# EAGLE design medidor-2 (EAGLE 9.6.2)
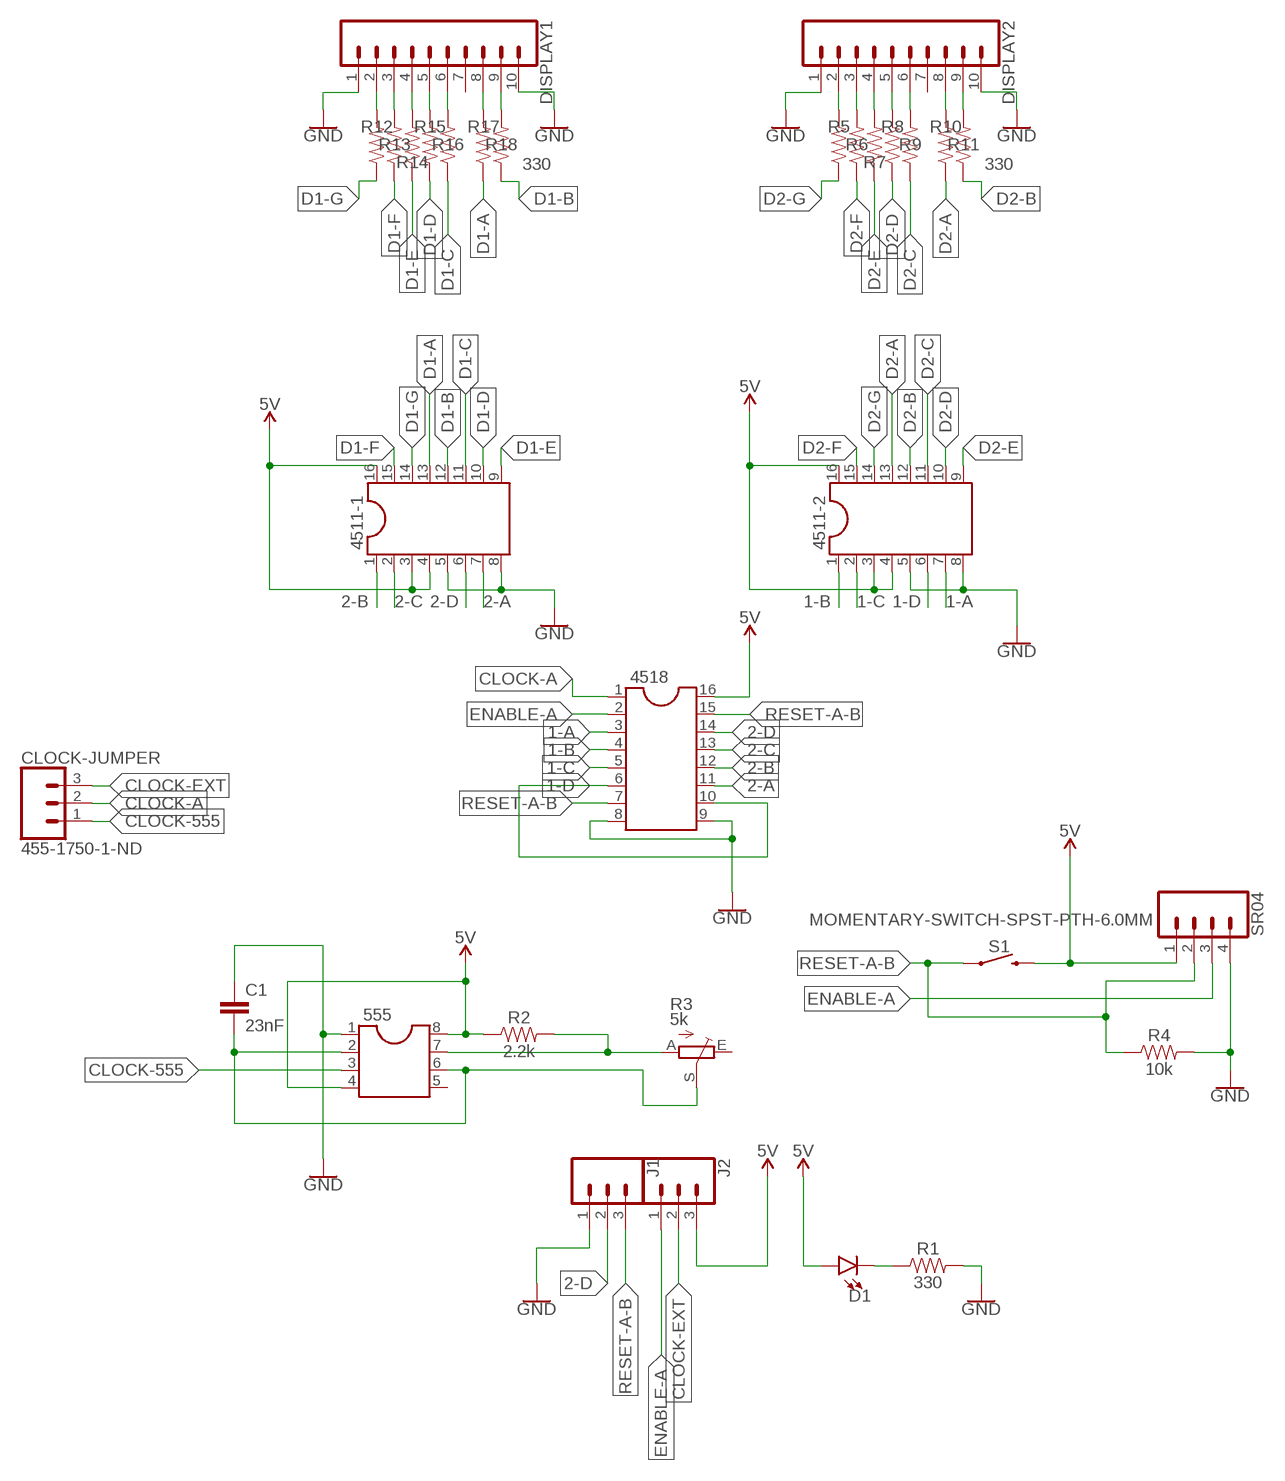
[diagram p0: schematic, sheet 1]

## Parts
555  DIL8  [DIL08]
4511-1  DIL16  [DIL16]
4511-2  DIL16  [DIL16]
4518  DIL16  [DIL16]
C1  23nF  C2,5-3  [C2.5-3]
CLOCK-JUMPER  455-1750-1-ND  CONN_03  [1X03]
D1  LED5MM  [LED_5MM]
DISPLAY1  CONN_10"  [1X10]
DISPLAY2  CONN_10"  [1X10]
J1  CONN_03-SCREW-5MM  [SCREWTERMINAL-5MM-3]
J2  CONN_03-SCREW-5MM  [SCREWTERMINAL-5MM-3]
R1  330  10KOHM-HORIZ-1/4W-5%  [AXIAL-0.3]
R2  2.2k  10KOHM-HORIZ-1/4W-5%  [AXIAL-0.3]
R3  5k  TRIM_EU-B25P  [B25P]
R4  10k  10KOHM-HORIZ-1/4W-5%  [AXIAL-0.3]
R5  330  10KOHM-HORIZ-1/4W-5%  [AXIAL-0.3]
R6  330  10KOHM-HORIZ-1/4W-5%  [AXIAL-0.3]
R7  330  10KOHM-HORIZ-1/4W-5%  [AXIAL-0.3]
R8  330  10KOHM-HORIZ-1/4W-5%  [AXIAL-0.3]
R9  330  10KOHM-HORIZ-1/4W-5%  [AXIAL-0.3]
R10  330  10KOHM-HORIZ-1/4W-5%  [AXIAL-0.3]
R11  330  10KOHM-HORIZ-1/4W-5%  [AXIAL-0.3]
R12  330  10KOHM-HORIZ-1/4W-5%  [AXIAL-0.3]
R13  330  10KOHM-HORIZ-1/4W-5%  [AXIAL-0.3]
R14  330  10KOHM-HORIZ-1/4W-5%  [AXIAL-0.3]
R15  330  10KOHM-HORIZ-1/4W-5%  [AXIAL-0.3]
R16  330  10KOHM-HORIZ-1/4W-5%  [AXIAL-0.3]
R17  330  10KOHM-HORIZ-1/4W-5%  [AXIAL-0.3]
R18  330  10KOHM-HORIZ-1/4W-5%  [AXIAL-0.3]
S1  MOMENTARY-SWITCH-SPST-PTH-6.0MM  [TACTILE_SWITCH_PTH_6.0MM]
SR04  CONN_04PTH  [1X04]

## Nets
1-A: 4511-2.7 4518.3
1-B: 4511-2.1 4518.4
1-C: 4511-2.2 4518.5
1-D: 4511-2.6 4518.6 4518.10
2-A: 4511-1.7 4518.11
2-B: 4511-1.1 4518.12
2-C: 4511-1.2 4518.13
2-D: 4511-1.6 4518.14 J1.2
5V: 555.4 555.8 4511-1.3 4511-1.4 4511-1.16 4511-2.3 4511-2.4 4511-2.16 4518.16 D1.A J2.3 R2.P$1 S1.3 SR04.1
CLOCK-555: 555.3 CLOCK-JUMPER.1
CLOCK-A: 4518.1 CLOCK-JUMPER.2
CLOCK-EXT: CLOCK-JUMPER.3 J2.2
D1-A: 4511-1.13 R17.P$1
D1-B: 4511-1.12 R18.P$1
D1-C: 4511-1.11 R16.P$1
D1-D: 4511-1.10 R15.P$1
D1-E: 4511-1.9 R14.P$1
D1-F: 4511-1.15 R13.P$1
D1-G: 4511-1.14 R12.P$1
D2-A: 4511-2.13 R10.P$1
D2-B: 4511-2.12 R11.P$1
D2-C: 4511-2.11 R9.P$1
D2-D: 4511-2.10 R8.P$1
D2-E: 4511-2.9 R7.P$1
D2-F: 4511-2.15 R6.P$1
D2-G: 4511-2.14 R5.P$1
ENABLE-A: 4518.2 J2.1 SR04.3
GND: 555.1 4511-1.5 4511-1.8 4511-2.5 4511-2.8 4518.8 4518.9 C1.1 DISPLAY1.1 DISPLAY1.10 DISPLAY2.1 DISPLAY2.10 J1.1 R1.P$2 R4.P$2 SR04.4
N$1: D1.K(C) R1.P$1
N$2: DISPLAY1.2 R12.P$2
N$3: 555.7 R2.P$2 R3.A
N$5: 555.2 555.6 C1.2 R3.S
N$6: DISPLAY1.3 R13.P$2
N$7: DISPLAY1.4 R14.P$2
N$8: DISPLAY1.5 R15.P$2
N$9: DISPLAY1.6 R16.P$2
N$10: DISPLAY1.8 R17.P$2
N$11: DISPLAY1.9 R18.P$2
N$12: DISPLAY2.2 R5.P$2
N$13: DISPLAY2.3 R6.P$2
N$14: DISPLAY2.4 R7.P$2
N$15: DISPLAY2.5 R8.P$2
N$16: DISPLAY2.6 R9.P$2
N$17: DISPLAY2.8 R10.P$2
N$18: DISPLAY2.9 R11.P$2
RESET-A-B: 4518.7 4518.15 J1.3 R4.P$1 S1.1 SR04.2
Unconnected: 555.5 DISPLAY1.7 DISPLAY2.7 R3.E

## Library data of the parts
555 = ic-package:DIL8: Dual In Line / Socket
4511-1 4511-2 4518 = ic-package:DIL16: Dual In Line / Socket
C1 = capacitor-wima:C: CAPACITOR naming: grid - package width
CLOCK-JUMPER = SparkFun-Connectors:CONN_03: Multi connection point. Often used as Generic Header-pin footprint for 0.1 inch spaced/style header connections On any of the 0.1 inch spaced packages, you can populate with these: Break Away Headers - Straight <https://www.sparkfun.com/products/116> (PRT-00116) Break Away Male Headers - Right Angle <https://www.sparkfun.com/products/553> (PRT-00553) Female Headers <https://www.sparkfun.com/products/115> (PRT-00115) Break Away Headers - Machine Pin <https://www.sparkfun.com/products/117> (PRT-00117) Break Away Female Headers - Swiss Machine Pin <https://www.sparkfun.com/products/743> (PRT-00743) Stackable Header - 3 Pin (Female, 0.1") <https://www.sparkfun.com/products/13875> (PRT-13875) For SCREWTERMINALS and SPRING TERMINALS visit here: Screw Terimnals on SparkFun.com <https://www.sparkfun.com/search/results?term=Screw+Terminals> (5mm/3.5mm/2.54mm spacing) This device is also useful as a general connection point to wire up your design to another part of your project. Our various solder wires solder well into these plated through hole pads. Hook-Up Wire - Assortment (Stranded, 22 AWG) <https://www.sparkfun.com/products/11375> (PRT-11375) Hook-Up Wire - Assortment (Solid Core, 22 AWG) <https://www.sparkfun.com/products/11367> (PRT-11367) View the entire wire category on our website here <https://www.sparkfun.com/categories/141> Special notes: Molex polarized connector foot print use with SKU : PRT-08232 with associated crimp pins and housings.; PROD_ID: XXX-00000
D1 = SparkFun-LED:LED: LED (Generic) Standard schematic elements and footprints for 5mm, 3mm, 1206, and 0603 sized LEDs. Generic LEDs with no color specified.
DISPLAY1 DISPLAY2 = SparkFun-Connectors:CONN_10: Multi connection point. Often used as Generic Header-pin footprint for 0.1 inch spaced/style header connections On any of the 0.1 inch spaced packages, you can populate with these: Break Away Headers - Straight <https://www.sparkfun.com/products/116> (PRT-00116) Break Away Male Headers - Right Angle <https://www.sparkfun.com/products/553> (PRT-00553) Female Headers <https://www.sparkfun.com/products/115> (PRT-00115) Break Away Headers - Machine Pin <https://www.sparkfun.com/products/117> (PRT-00117) Break Away Female Headers - Swiss Machine Pin <https://www.sparkfun.com/products/743> (PRT-00743) Arduino Stackable Header - 10 Pin <https://www.sparkfun.com/products/11376> (PRT-11376) For SCREWTERMINALS and SPRING TERMINALS visit here: Screw Terimnals on SparkFun.com <https://www.sparkfun.com/search/results?term=Screw+Terminals> (5mm/3.5mm/2.54mm spacing) This device is also useful as a general connection point to wire up your design to another part of your project. Our various solder wires solder well into these plated through hole pads. Hook-Up Wire - Assortment (Stranded, 22 AWG) <https://www.sparkfun.com/products/11375> (PRT-11375) Hook-Up Wire - Assortment (Solid Core, 22 AWG) <https://www.sparkfun.com/products/11367> (PRT-11367) View the entire wire category on our website here <https://www.sparkfun.com/categories/141> Special notes: Molex polarized connector foot print use with SKU : PRT-08231 with associated crimp pins and housings. 1MM SMD Version SKU: PRT-10208 NOTES ON THE VARIANTS LOCK and LOCK_LONGPADS... This footprint was designed to help hold the alignment of a through-hole component (i.e. 6-pin header) while soldering it into place. You may notice that each hole has been shifted either up or down by 0.005 of an inch from it's more standard position (which is a perfectly straight line). This slight alteration caused the pins (the squares in the middle) to touch the edges of the holes. Because they are alternating, it causes a "brace" to hold the component in place. 0.005 has proven to be the perfect amount of "off-center" position when using our standard breakaway headers. Although looks a little odd when you look at the bare footprint, once you have a header in there, the alteration is very hard to notice. Also,if you push a header all the way into place, it is covered up entirely on the bottom side.; PROD_ID: CONN-11563
J1 J2 = SparkFun-Connectors:CONN_03: Multi connection point. Often used as Generic Header-pin footprint for 0.1 inch spaced/style header connections On any of the 0.1 inch spaced packages, you can populate with these: Break Away Headers - Straight <https://www.sparkfun.com/products/116> (PRT-00116) Break Away Male Headers - Right Angle <https://www.sparkfun.com/products/553> (PRT-00553) Female Headers <https://www.sparkfun.com/products/115> (PRT-00115) Break Away Headers - Machine Pin <https://www.sparkfun.com/products/117> (PRT-00117) Break Away Female Headers - Swiss Machine Pin <https://www.sparkfun.com/products/743> (PRT-00743) Stackable Header - 3 Pin (Female, 0.1") <https://www.sparkfun.com/products/13875> (PRT-13875) For SCREWTERMINALS and SPRING TERMINALS visit here: Screw Terimnals on SparkFun.com <https://www.sparkfun.com/search/results?term=Screw+Terminals> (5mm/3.5mm/2.54mm spacing) This device is also useful as a general connection point to wire up your design to another part of your project. Our various solder wires solder well into these plated through hole pads. Hook-Up Wire - Assortment (Stranded, 22 AWG) <https://www.sparkfun.com/products/11375> (PRT-11375) Hook-Up Wire - Assortment (Solid Core, 22 AWG) <https://www.sparkfun.com/products/11367> (PRT-11367) View the entire wire category on our website here <https://www.sparkfun.com/categories/141> Special notes: Molex polarized connector foot print use with SKU : PRT-08232 with associated crimp pins and housings.; PROD_ID: CONN-10134; SF_SKU: PRT-08433
R1 R2 R5-R18 = SparkFun-Resistors:10KOHM: 10kΩ resistor A resistor is a passive two-terminal electrical component that implements electrical resistance as a circuit element. Resistors act to reduce current flow, and, at the same time, act to lower voltage levels within circuits. - Wikipedia; PROD_ID: RES-09435; VALUE: 10k
R3 = pot:TRIM_EU-: POTENTIOMETER
R4 = SparkFun-Resistors:10KOHM: 10kΩ resistor A resistor is a passive two-terminal electrical component that implements electrical resistance as a circuit element. Resistors act to reduce current flow, and, at the same time, act to lower voltage levels within circuits. - Wikipedia; PROD_ID: RES-09435
S1 = SparkFun-Switches:MOMENTARY-SWITCH-SPST: Momentary Switch (Pushbutton) - SPST Normally-open (NO) SPST momentary switches (buttons, pushbuttons). Variants PTH-12MM - 12mm square, through-hole Momentary Pushbutton Switch - 12mm Square <https://www.sparkfun.com/products/9190> (COM-09190) PTH-6.0MM, PTH-6.0MM-KIT - 6.0mm square, through-hole Mini Pushbutton Switch <https://www.sparkfun.com/products/97> (COM-00097) KIT package intended for soldering kit's - only one side of pads' copper is exposed. PTH-RIGHT-ANGLE-KIT - Right-angle, through-hole Right Angle Tactile Button <https://www.sparkfun.com/products/10791> - Used on SparkFun BigTime Watch Kit <https://www.sparkfun.com/products/11734> SMD-12MM - 12mm square, surface-mount Tactile Button - SMD (12mm) <https://www.sparkfun.com/products/12993> (COM-12993) Used on SparkFun PicoBoard <https://www.sparkfun.com/products/11888> SMD-4.5MM - 4.5mm Square Trackball Switch Used on SparkFun Blackberry Trackballer Breakout <https://www.sparkfun.com/products/13169> SMD-4.6MMX2.8MM - 4.60mm x 2.80mm, surface mount Used on SparkFun SAMD21 Mini Breakout <https://www.sparkfun.com/products/13664> SMD-5.2MM, SMD-5.2-REDUNDANT - 5.2mm square, surface-mount Mini Pushbutton Switch - SMD <https://www.sparkfun.com/products/8720> (COM-08720) Used on Arduino Pro Mini <https://www.sparkfun.com/products/11114> REDUNDANT package connects both switch circuits together SMD-6.0X3.5MM - 6.0 x 3.5mm, surface mount Momentary Reset Switch SMD <https://www.sparkfun.com/products/8229> (COM-08229) SMD-6.2MM-TALL - 6.2mm square, surface mount Tactile Button - SMD (6mm) <https://www.sparkfun.com/products/12992> Used on SparkFun Digital Sandbox <https://www.sparkfun.com/products/12651> SMD-RIGHT-ANGLE - Right-angle, surface mount Used on SparkFun Block for Intel® Edison - Arduino <https://www.sparkfun.com/products/13036>; PROD_ID: SWCH-08441; SF_SKU: COM-00097
SR04 = SparkFun-Connectors:CONN_04: Multi connection point. Often used as Generic Header-pin footprint for 0.1 inch spaced/style header connections On any of the 0.1 inch spaced packages, you can populate with these: Break Away Headers - Straight <https://www.sparkfun.com/products/116> (PRT-00116) Break Away Male Headers - Right Angle <https://www.sparkfun.com/products/553> (PRT-00553) Female Headers <https://www.sparkfun.com/products/115> (PRT-00115) Break Away Headers - Machine Pin <https://www.sparkfun.com/products/117> (PRT-00117) Break Away Female Headers - Swiss Machine Pin <https://www.sparkfun.com/products/743> (PRT-00743) For SCREWTERMINALS and SPRING TERMINALS visit here: Screw Terimnals on SparkFun.com <https://www.sparkfun.com/search/results?term=Screw+Terminals> (5mm/3.5mm/2.54mm spacing) This device is also useful as a general connection point to wire up your design to another part of your project. Our various solder wires solder well into these plated through hole pads. Hook-Up Wire - Assortment (Stranded, 22 AWG) <https://www.sparkfun.com/products/11375> (PRT-11375) Hook-Up Wire - Assortment (Solid Core, 22 AWG) <https://www.sparkfun.com/products/11367> (PRT-11367) View the entire wire category on our website here <https://www.sparkfun.com/categories/141> Special notes: Molex polarized connector foot print use with SKU : PRT-08231 with associated crimp pins and housings. 1MM SMD Version SKU: PRT-10208; PROD_ID: CONN-09696

## Board
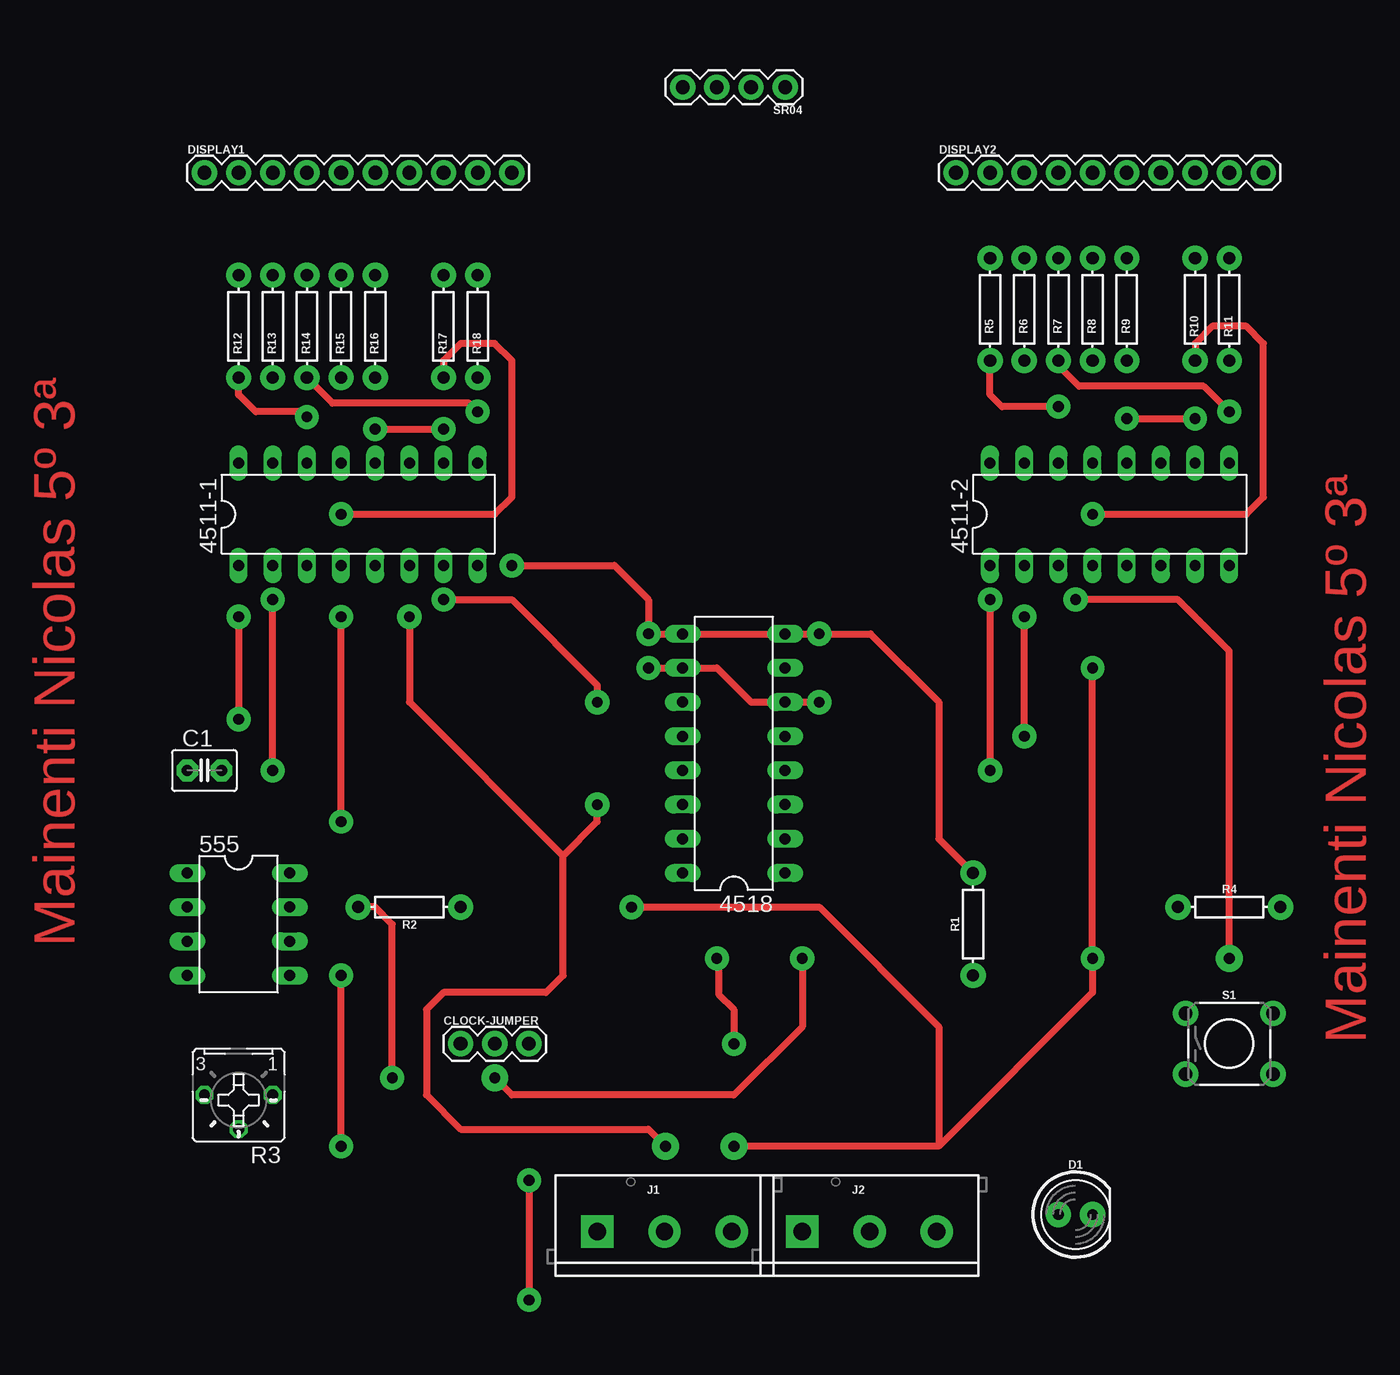
[diagram p1: board, top side]
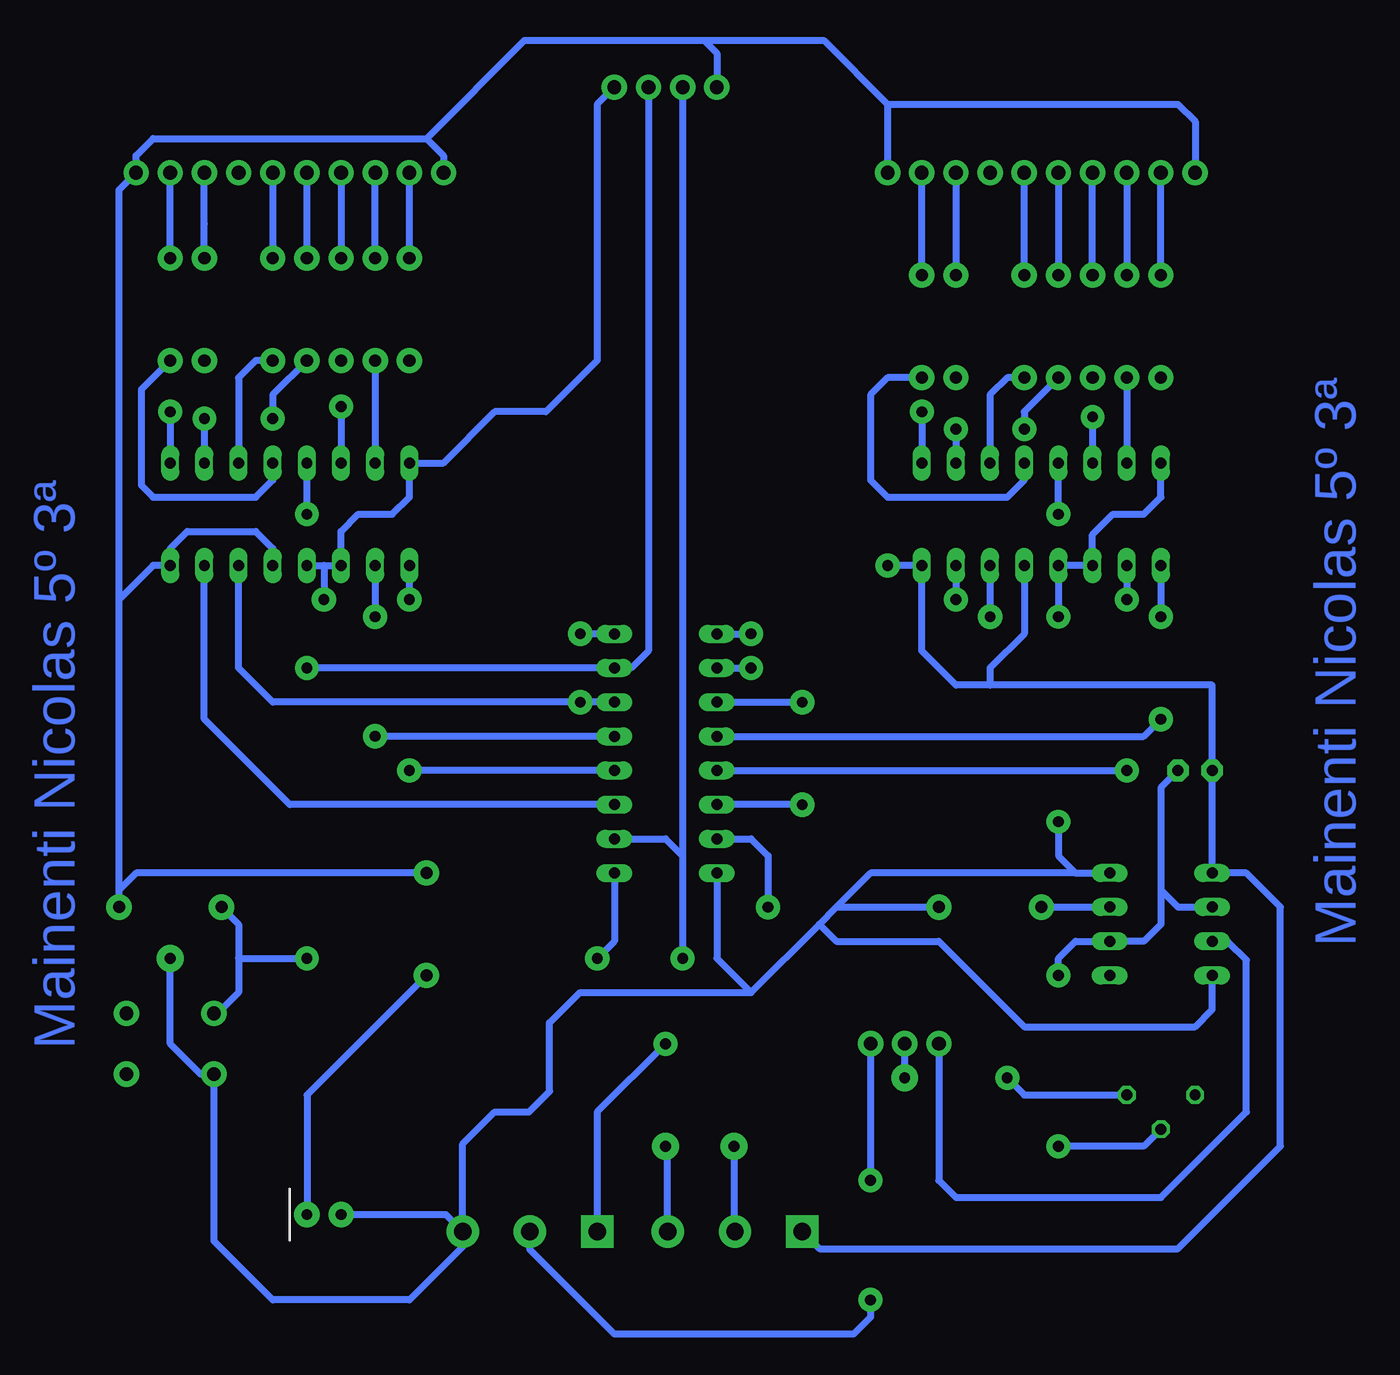
[diagram p2: board, bottom side, seen from below]

No outline drawn. Coordinates in mm, seen from the top.
Copper layers (1*16): Top 0.035mm / dielectric 1.5mm / Bottom 0.035mm
Design rules "default": minimum track width 6mil, minimum drill 0.35mm, track to track 6mil, track to pad 6mil, pad to pad 6mil, via to via 6mil, smd to smd 6mil, copper to edge 40mil, drill to drill 6mil, minimum pad ring 10mil, minimum via ring 8mil, stop-mask expansion 4mil, vias tented up to drill 0mil, thermal gap 10mil

### Footprints (pad centres in the part's own frame; a part is rotated, then mirrored left to right if it is on the bottom)
DIL08 = drill 0.813 long: 1 -3.81,-3.81; 2 -1.27,-3.81; 3 1.27,-3.81; 4 3.81,-3.81; 5 3.81,3.81; 6 1.27,3.81; 7 -1.27,3.81; 8 -3.81,3.81
DIL16 = drill 0.813 long: 1 -8.89,-3.81; 2 -6.35,-3.81; 3 -3.81,-3.81; 4 -1.27,-3.81; 5 1.27,-3.81; 6 3.81,-3.81; 7 6.35,-3.81; 8 8.89,-3.81; 9 8.89,3.81; 10 6.35,3.81; 11 3.81,3.81; 12 1.27,3.81; 13 -1.27,3.81; 14 -3.81,3.81; 15 -6.35,3.81; 16 -8.89,3.81
C2.5-3 = drill 0.813 pad 1.6 octagon: 1 -1.27,0; 2 1.27,0
1X03 = drill 1.016 pad 1.88: 1 0,0; 2 2.54,0; 3 5.08,0
LED_5MM = drill 0.813 pad 1.88: A -1.27,0; K 1.27,0
1X10 = drill 1.016 pad 1.88: 1 0,0; 2 2.54,0; 3 5.08,0; 4 7.62,0; 5 10.16,0; 6 12.7,0; 7 15.24,0; 8 17.78,0; 9 20.32,0; 10 22.86,0
SCREWTERMINAL-5MM-3 = drill 1.3 pad 2.413 square: 1 0,0 | drill 1.3 pad 2.413: 2 5,0; 3 10,0
AXIAL-0.3 = drill 0.9 pad 1.88: P$1 -3.81,0; P$2 3.81,0
B25P = drill 0.813 octagon: A -2.54,0; E 2.54,0; S 0,2.54
TACTILE_SWITCH_PTH_6.0MM = drill 1.016 pad 1.88: 1 -3.251,2.261; 2 3.251,2.261; 3 -3.251,-2.261; 4 3.251,-2.261
1X04 = drill 1.016 pad 1.88: 1 0,0; 2 2.54,0; 3 5.08,0; 4 7.62,0

### Placement (x,y rotation side)
555  43.18,33.02 270 top
4511-1  52.07,63.5 0 top
4511-2  107.95,63.5 0 top
4518  80.01,45.72 90 top
C1  40.64,44.45 0 top
CLOCK-JUMPER  59.69,24.13 0 top
D1  105.41,11.43 0 top
DISPLAY1  40.64,88.9 0 top
DISPLAY2  96.52,88.9 0 top
J1  69.85,10.16 0 top
J2  85.09,10.16 0 top
R1  97.79,33.02 90 top
R2  55.88,34.29 180 top
R3  43.18,20.32 180 top
R4  116.84,34.29 0 top
R5  99.06,78.74 90 top
R6  101.6,78.74 90 top
R7  104.14,78.74 90 top
R8  106.68,78.74 90 top
R9  109.22,78.74 90 top
R10  114.3,78.74 90 top
R11  116.84,78.74 90 top
R12  43.18,77.47 90 top
R13  45.72,77.47 90 top
R14  48.26,77.47 90 top
R15  50.8,77.47 90 top
R16  53.34,77.47 90 top
R17  58.42,77.47 90 top
R18  60.96,77.47 90 top
S1  116.84,24.13 0 top
SR04  83.82,95.25 180 top

### Tracks (layer width: path | path; a pad name or v marks a point on that pad's centre or on a via)
1-A
  Bottom 0.508: 4518.3 107.95,41.91 114.3,48.26 4511-2.7
1-B  (via drill 0.8 pad 1.8)
  Top 0.508: v99.06,57.15 v99.06,44.45
  Bottom 0.508: v99.06,57.15 4511-2.1 | 4518.4 v99.06,44.45
1-C  (via drill 0.8 pad 1.8)
  Top 0.508: v101.6,46.99 v101.6,55.88
  Bottom 0.508: 4518.5 v101.6,46.99 | 4511-2.2 v101.6,55.88
1-D  (via drill 0.8 pad 1.8)
  Top 0.508: v73.66,52.07 78.74,52.07 81.28,49.53 v86.36,49.53
  Bottom 0.508: 4518.6 v86.36,49.53 109.22,49.53 111.76,52.07 4511-2.6 | 4518.10 v73.66,52.07
2-A  (via drill 0.8 pad 1.8)
  Top 0.508: v58.42,57.15 63.5,57.15 69.85,50.8 v69.85,49.53
  Bottom 0.508: 4518.11 v69.85,49.53 | 4511-1.7 v58.42,57.15
2-B  (via drill 0.8 pad 1.8)
  Top 0.508: v43.18,55.88 v43.18,48.26
  Bottom 0.508: 4511-1.1 v43.18,55.88 | v43.18,48.26 44.45,46.99 4518.12
2-C  (via drill 0.8 pad 1.8)
  Top 0.508: v45.72,44.45 v45.72,57.15
  Bottom 0.508: 4511-1.2 v45.72,57.15 | 4518.13 v45.72,44.45
2-D  (via drill 0.8 pad 1.8, 0.8 pad 2)
  Top 0.508: 67.31,38.1 67.31,29.21 66.04,27.94 58.42,27.94 57.15,26.67 57.15,20.32 59.69,17.78 73.66,17.78 v74.93,16.51 | 67.31,38.1 55.88,49.53 v55.88,55.88 | 67.31,38.1 69.85,40.64 v69.85,41.91
  Bottom 0.508: v74.93,16.51 74.93,10.24 J1.2 | v69.85,41.91 4518.14 | 4511-1.6 v55.88,55.88
5V  (via drill 0.8 pad 1.78, 0.8 pad 1.8, 0.8 pad 2)
  Top 0.508: v50.8,40.64 v50.8,55.88 | v105.41,57.15 113.03,57.15 116.84,53.34 v116.84,30.48
  Bottom 0.508: 88.62,25.68 86.36,27.94 73.66,27.94 | 73.66,27.94 68.58,33.02 | 68.58,33.02 67.31,34.29 | 67.31,34.29 R2.P$1 | 67.31,34.29 64.77,36.83 49.53,36.83 | 49.53,36.83 555.8 | 68.58,33.02 67.31,31.75 59.69,31.75 53.34,25.4 40.64,25.4 39.37,26.67 555.4 | v50.8,55.88 4511-1.4 4511-1.3 48.26,61.98 46.74,63.5 44.45,63.5 43.18,64.77 4511-1.16 | v50.8,40.64 50.8,38.1 49.53,36.83 | 88.62,25.68 88.65,25.71 | 4511-2.4 105.41,59.69 | 105.41,59.69 4511-2.3 104.14,62.23 102.87,63.5 100.33,63.5 99.06,64.77 4511-2.16 96.52,67.31 92.71,71.12 88.9,71.12 85.09,74.93 85.09,93.98 SR04.1 | 105.41,59.69 v105.41,57.15 | J2.3 95.09,9.05 99.06,5.08 109.22,5.08 113.59,9.45 S1.3 114.58,21.87 116.84,24.13 v116.84,30.48 | D1.A 96.36,11.43 J2.3 | J2.3 95.09,16.67 92.71,19.05 90.17,19.05 88.62,20.6 88.62,25.68 | 4518.16 76.2,30.48 73.66,27.94
CLOCK-555
  Bottom 0.508: CLOCK-JUMPER.1 59.69,13.97 58.42,12.7 43.18,12.7 36.83,19.05 36.83,30.35 38.23,31.75 555.3
CLOCK-A  (via drill 0.8 pad 1.8, 0.8 pad 2)
  Top 0.508: v62.23,21.59 63.5,20.32 80.01,20.32 85.09,25.4 v85.09,30.48
  Bottom 0.508: v62.23,21.59 CLOCK-JUMPER.2 | v85.09,30.48 83.82,31.75 4518.1
CLOCK-EXT  (via drill 0.8 pad 1.78)
  Top 0.508: v64.77,13.97 v64.77,5.08
  Bottom 0.508: CLOCK-JUMPER.3 v64.77,13.97 | v64.77,5.08 64.77,3.81 66.04,2.54 83.82,2.54 90.09,8.81 J2.2
D1-A  (via drill 0.8 pad 1.78)
  Top 0.508: v50.8,63.5 62.23,63.5 63.5,64.77 63.5,74.93 62.23,76.2 59.69,76.2 58.42,74.93 R17.P$1
  Bottom 0.508: v50.8,63.5 4511-1.13
D1-B
  Bottom 0.508: R18.P$1 63.5,73.66 64.77,72.39 64.77,66.04 63.5,64.77 54.61,64.77 53.34,66.04 4511-1.12
D1-C
  Bottom 0.508: R16.P$1 54.61,73.66 55.88,72.39 4511-1.11
D1-D  (via drill 0.8 pad 1.78)
  Top 0.508: v53.34,69.83 v58.42,69.83
  Bottom 0.508: R15.P$1 53.34,71.12 v53.34,69.83 | v58.42,69.83 4511-1.10
D1-E  (via drill 0.8 pad 1.78)
  Top 0.508: v60.96,71.12 60.33,71.75 50.16,71.75 R14.P$1
  Bottom 0.508: v60.96,71.12 4511-1.9
D1-F
  Bottom 0.508: R13.P$1 4511-1.15
D1-G  (via drill 0.8 pad 1.78)
  Top 0.508: v48.26,70.74 47.88,71.12 44.45,71.12 43.18,72.39 R12.P$1
  Bottom 0.508: v48.26,70.74 4511-1.14
D2-A  (via drill 0.8 pad 1.78)
  Top 0.508: v106.68,63.5 118.11,63.5 119.38,64.77 119.38,76.2 118.11,77.47 115.57,77.47 114.3,76.2 R10.P$1
  Bottom 0.508: v106.68,63.5 4511-2.13
D2-B
  Bottom 0.508: R11.P$1 119,72.77 119,65.66 118.11,64.77 110.49,64.77 109.22,66.04 4511-2.12
D2-C
  Bottom 0.508: R9.P$1 110.49,74.93 111.76,73.66 4511-2.11
D2-D  (via drill 0.8 pad 1.78)
  Top 0.508: v109.22,70.61 v114.3,70.61
  Bottom 0.508: R8.P$1 109.22,72.39 v109.22,70.61 | v114.3,70.61 4511-2.10
D2-E  (via drill 0.8 pad 1.78)
  Top 0.508: v116.84,71.12 114.94,73.03 105.66,73.03 104.14,74.55 R7.P$1
  Bottom 0.508: v116.84,71.12 4511-2.9
D2-F
  Bottom 0.508: R6.P$1 4511-2.15
D2-G  (via drill 0.8 pad 1.8)
  Top 0.508: v104.14,71.5 99.95,71.5 99.06,72.39 R5.P$1
  Bottom 0.508: v104.14,71.5 4511-2.14
ENABLE-A  (via drill 0.8 pad 1.78)
  Top 0.508: v78.74,30.48 78.87,30.35 78.87,27.81 80.01,26.67 v80.01,24.13
  Bottom 0.508: SR04.3 78.74,38.1 | 78.74,38.1 v78.74,30.48 | 80.35,23.79 v80.01,24.13 85.09,19.05 J2.1 | 78.74,38.1 80.01,39.37 4518.2
GND  (via drill 0.8 pad 1.8)
  Top 0.508: v63.5,59.69 71.12,59.69 73.66,57.15 v73.66,54.61 v86.36,54.61 90.17,54.61 95.25,49.53 95.25,39.37 R1.P$2
  Bottom 0.508: 55.88,50.8 39.37,50.8 C1.1 555.1 36.83,36.83 34.29,34.29 34.29,16.51 41.91,8.89 68.58,8.89 J1.1 | 55.88,50.8 58.42,50.8 60.96,53.34 4511-1.8 v63.5,59.69 | 55.88,50.8 55.88,52.07 53.34,54.61 4511-1.5 | R4.P$2 120.65,35.56 | 120.65,35.56 120.65,57.15 | 120.65,57.15 120.65,87.63 DISPLAY2.10 119.38,90.17 118.11,91.44 97.79,91.44 | 97.79,91.44 96.52,90.17 DISPLAY2.1 | 97.79,91.44 90.5,98.73 77.14,98.73 | 77.14,98.73 76.2,97.79 SR04.4 | 63.5,93.98 68.25,98.73 77.14,98.73 | 63.5,93.98 DISPLAY1.10 | DISPLAY1.1 40.64,92.71 41.91,93.98 63.5,93.98 | 120.65,57.15 118.11,59.69 4511-2.8 116.84,60.96 115.57,62.23 110.49,62.23 109.22,60.96 4511-2.5 | R1.P$2 119.38,36.83 120.65,35.56 | 4518.9 v73.66,54.61 | 4518.8 v86.36,54.61
N$1
  Bottom 0.508: R1.P$1 106.68,20.32 D1.K
N$2
  Bottom 0.508: R12.P$2 DISPLAY1.2
N$3  (via drill 0.8 pad 1.78)
  Top 0.508: R2.P$2 53.34,34.29 54.61,33.02 v54.61,21.59
  Bottom 0.508: R2.P$2 555.7 | v54.61,21.59 53.34,20.32 R3.A
N$5  (via drill 0.8 pad 1.78)
  Top 0.508: v50.8,16.51 v50.8,29.21
  Bottom 0.508: C1.2 43.18,43.18 43.18,35.56 | 43.18,35.56 41.91,34.29 555.2 | 43.18,35.56 43.18,33.02 44.45,31.75 555.6 49.53,31.75 50.8,30.48 v50.8,29.21 | R3.S 44.45,16.51 v50.8,16.51
N$6
  Bottom 0.508: DISPLAY1.3 R13.P$2
N$7
  Bottom 0.508: R14.P$2 DISPLAY1.4
N$8
  Bottom 0.508: DISPLAY1.5 R15.P$2
N$9
  Bottom 0.508: R16.P$2 DISPLAY1.6
N$10
  Bottom 0.508: DISPLAY1.8 R17.P$2
N$11
  Bottom 0.508: R18.P$2 DISPLAY1.9
N$12
  Bottom 0.508: R5.P$2 DISPLAY2.2
N$13
  Bottom 0.508: R6.P$2 DISPLAY2.3
N$14
  Bottom 0.508: DISPLAY2.4 R7.P$2
N$15
  Bottom 0.508: R8.P$2 DISPLAY2.5
N$16
  Bottom 0.508: DISPLAY2.6 R9.P$2
N$17
  Bottom 0.508: R10.P$2 114.3,85.09 DISPLAY2.8
N$18
  Bottom 0.508: R11.P$2 DISPLAY2.9
RESET-A-B  (via drill 0.8 pad 1.78, 0.8 pad 1.8, 0.8 pad 2)
  Top 0.508: v106.68,52.07 v106.68,30.48 106.68,27.94 95.25,16.51 | 95.25,16.51 v80.01,16.51 | v72.39,34.29 86.36,34.29 95.25,25.4 95.25,16.51
  Bottom 0.508: R4.P$1 111.76,33.02 111.76,30.48 | 111.76,30.48 111.76,27.94 113.31,26.39 S1.1 | SR04.2 81.28,53.34 82.55,52.07 4518.7 v106.68,52.07 | 111.76,30.48 v106.68,30.48 | J1.3 79.85,16.35 v80.01,16.51 | 4518.15 73.66,39.37 72.39,38.1 v72.39,34.29

### Text on the board
Top: Mainenti Nicolas 5º 3ª | Mainenti Nicolas 5º 3ª
Bottom: Mainenti Nicolas 5º 3ª | Mainenti Nicolas 5º 3ª